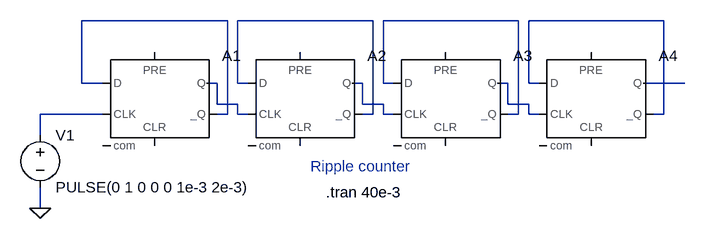
[diagram p0: schematic RippleCounter.asc]
RippleCounter.asc, the LTspice schematic file:
Version 4
SHEET 1 880 680
WIRE 112 96 -112 96
WIRE 336 96 128 96
WIRE 560 96 352 96
WIRE 784 96 576 96
WIRE -112 192 -112 96
WIRE -80 192 -112 192
WIRE 96 192 80 192
WIRE 128 192 128 96
WIRE 144 192 128 192
WIRE 320 192 304 192
WIRE 352 192 352 96
WIRE 368 192 352 192
WIRE 544 192 528 192
WIRE 576 192 576 96
WIRE 592 192 576 192
WIRE 816 192 752 192
WIRE 96 224 96 192
WIRE 128 224 96 224
WIRE 320 224 320 192
WIRE 352 224 320 224
WIRE 544 224 544 192
WIRE 576 224 544 224
WIRE -80 240 -176 240
WIRE 112 240 112 96
WIRE 112 240 96 240
WIRE 128 240 128 224
WIRE 144 240 128 240
WIRE 336 240 336 96
WIRE 336 240 320 240
WIRE 352 240 352 224
WIRE 368 240 352 240
WIRE 560 240 560 96
WIRE 560 240 544 240
WIRE 576 240 576 224
WIRE 592 240 576 240
WIRE 784 240 784 96
WIRE 784 240 768 240
WIRE -176 272 -176 240
WIRE -176 384 -176 352
FLAG -176 384 0
SYMBOL Digital\\dflop 0 144 R0
SYMATTR InstName A1
SYMBOL Digital\\dflop 224 144 R0
SYMATTR InstName A2
SYMBOL Digital\\dflop 448 144 R0
SYMATTR InstName A3
SYMBOL Digital\\dflop 672 144 R0
SYMATTR InstName A4
SYMBOL voltage -176 256 R0
WINDOW 123 0 0 Left 0
WINDOW 39 0 0 Left 0
SYMATTR InstName V1
SYMATTR Value PULSE(0 1 0 0 0 1e-3 2e-3)
TEXT 264 360 Left 0 !.tran 40e-3
TEXT 240 320 Left 0 ;Ripple counter

The netlist it stands for:
* RippleCounter.asc
A1 N001 0 N009 0 0 N001 N005 0 DFLOP
A2 N002 0 N005 0 0 N002 N006 0 DFLOP
A3 N003 0 N006 0 0 N003 N007 0 DFLOP
A4 N004 0 N007 0 0 N004 N008 0 DFLOP
V1 N009 0 PULSE(0 1 0 0 0 1e-3 2e-3)
.tran 40e-3
* Ripple counter
.backanno
.end